# Altium schematic sheet [02] - BLOCK DIAGRAM.SchDoc: BLOCK DIAGRAM
size A4; Organization: Bjørn T. Brodtkorb; Address1: Frode Rinnans veg 161; Address2: 7050 Trondheim; DocumentNumber: 3; Revision: 1.0; SheetNumber: 3; SheetTotal: 13
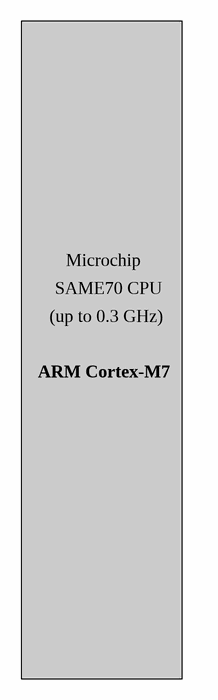
[diagram p0: [02] - BLOCK DIAGRAM.SchDoc]

## Notes on the sheet
- Microchip
- (up to 0.3 GHz)
- SAME70 CPU
- ARM Cortex-M7
- Title
- Size:
- Date:
- A4
- Number:
- Time:
- Revision:
- Sheet
- of
- StrawberryHacker
- File: